# Altium schematic sheet STM32.SchDoc
size A3
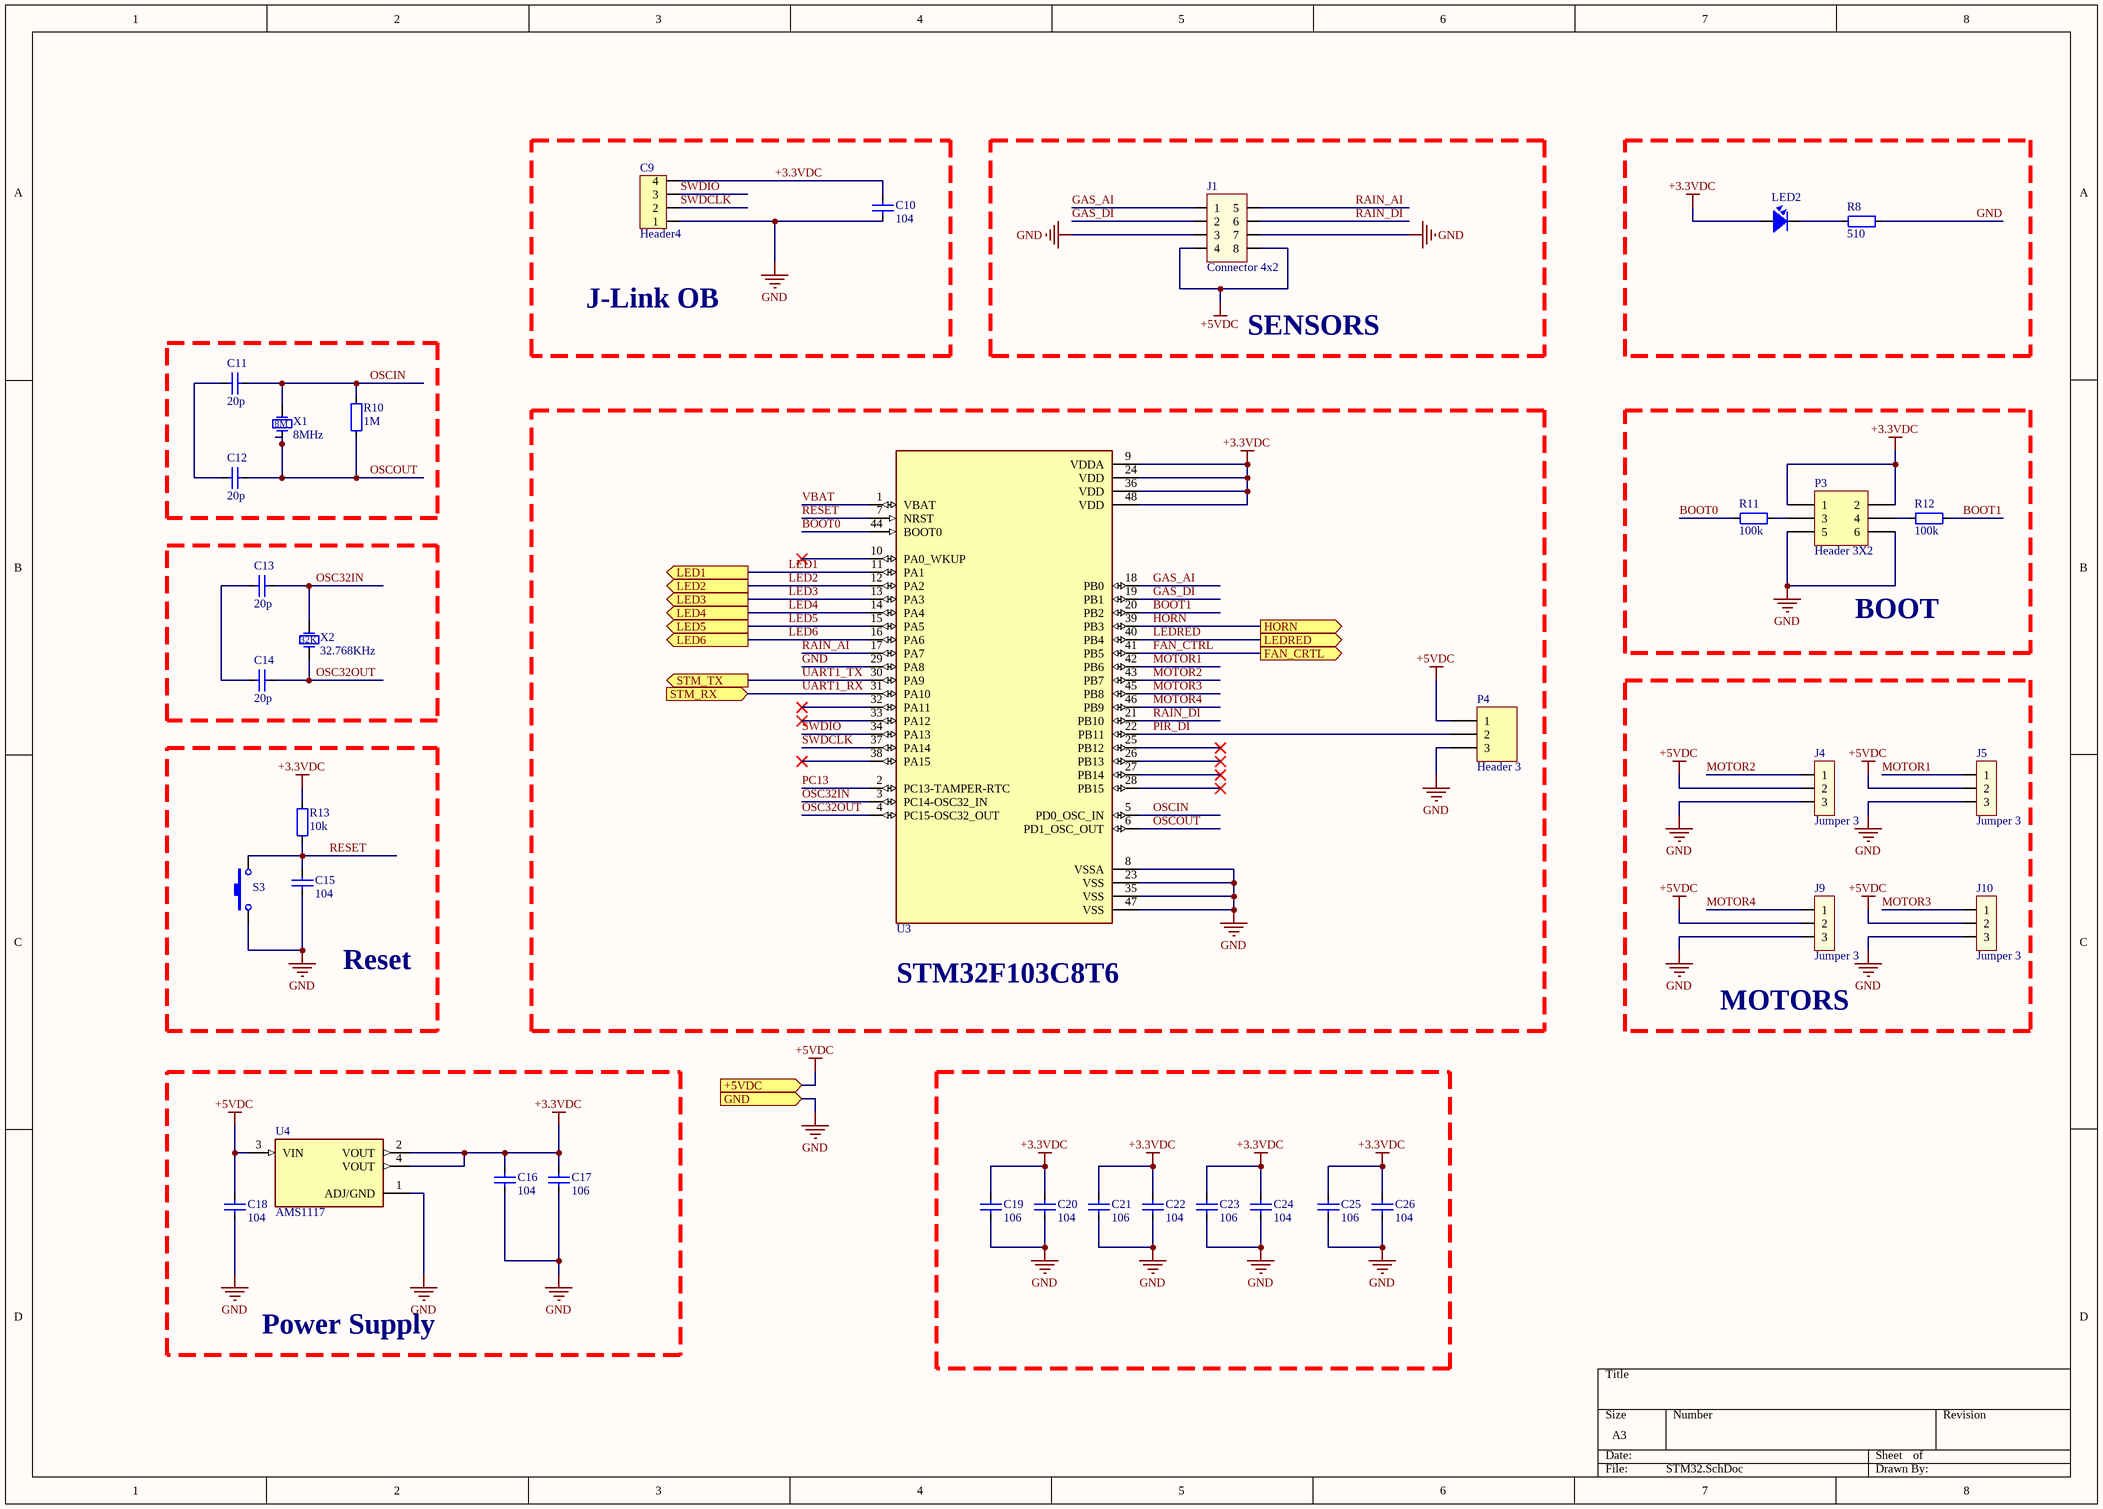
[diagram p0: STM32.SchDoc]

## Parts
C9  Header4  [Header4]
C10  104  [CAP_0805]
C11  20p  [CAP_0805]
C12  20p  [CAP_0805]
C13  20p  [CAP_0805]
C14  20p  [CAP_0805]
C15  104  [CAP_0805]
C16  104  [CAP_0805]
C17  106  [CAP_0805]
C18  104  [CAP_0805]
C19  106  [CAP_0805]
C20  104  [CAP_0805]
C21  106  [CAP_0805]
C22  104  [CAP_0805]
C23  106  [CAP_0805]
C24  104  [CAP_0805]
C25  106  [CAP_0805]
C26  104  [CAP_0805]
J1  Connector 4x2  [JP4x2]
J4  Jumper 3  [JP3]
J5  Jumper 3  [JP3]
J9  Jumper 3  [JP3]
J10  Jumper 3  [JP3]
LED2  LED  [LED-0805-Red]  (value not drawn)
P3  Header 3X2  [HDR2X3]
P4  Header 3  [HDR1X3]
R8  510  [RES-SMD-0805]
R10  1M  [RES-SMD-0805]
R11  100k  [RES-SMD-0805]
R12  100k  [RES-SMD-0805]
R13  10k  [RES-SMD-0805]
S3  SW-SMD  [SW-SMD]  (value not drawn)
U3  STM32  [LQFP 48]  (value not drawn)
U4  AMS1117  [SOT229P700X180-4N]
X1  8MHz  [CRYSTAL_ABM3 5x3.2mm]
X2  32.768KHz  [Crystal_ABS07_SMD-3.2x1.5MM]

## Blocks framed on the sheet
J-Link OB: C9 C10
SENSORS: J1
STM32F103C8T6: P4 U3
BOOT: P3 R11 R12
MOTORS: J4 J5 J9 J10
Reset: C15 R13 S3
Power Supply: C16-C18 U4

## Ports
+5VDC (in), FAN_CRTL (out), GND (in), HORN (out), LED1 (out), LED2 (out), LED3 (out), LED4 (out), LED5 (out), LED6 (out), LEDRED (out), STM_RX (in), STM_TX (out)

## Nets
+3.3VDC: C9.4 C10.2 C16.2 C17.2 C19.2 C20.2 C21.2 C22.2 C23.2 C24.2 C25.2 C26.2 LED2.1 P3.1 P3.2 R13.2 U3.9(VDDA) U3.24(VDD) U3.36(VDD) U3.48(VDD) U4.2(VOUT) U4.4(VOUT)
+5VDC: C18.2 J1.4 J1.8 J4.2 J5.2 J9.2 J10.2 P4.1 U4.3(VIN) ; port +5VDC
GND: C9.1 C10.1 C15.1 C16.1 C17.1 C18.1 C19.1 C20.1 C21.1 C22.1 C23.1 C24.1 C25.1 C26.1 J1.3 J1.7 J4.3 J5.3 J9.3 J10.3 P3.5 P3.6 P4.3 R8.1 S3.1 U3.8(VSSA) U3.23(VSS) U3.29(PA8) U3.35(VSS) U3.47(VSS) U4.1(ADJ/GND) ; port GND
BOOT0: R11.2 U3.44(BOOT0)
BOOT1: R12.1 U3.20(PB2)
FAN_CTRL: U3.41(PB5) ; port FAN_CRTL
GAS_AI: J1.1 U3.18(PB0)
GAS_DI: J1.2 U3.19(PB1)
HORN: U3.39(PB3) ; port HORN
LED1: U3.11(PA1) ; port LED1
LED2: U3.12(PA2) ; port LED2
LED3: U3.13(PA3) ; port LED3
LED4: U3.14(PA4) ; port LED4
LED5: U3.15(PA5) ; port LED5
LED6: U3.16(PA6) ; port LED6
LEDRED: U3.40(PB4) ; port LEDRED
MOTOR1: J5.1 U3.42(PB6)
MOTOR2: J4.1 U3.43(PB7)
MOTOR3: J10.1 U3.45(PB8)
MOTOR4: J9.1 U3.46(PB9)
OSC32IN: C13.1 U3.3(PC14-OSC32_IN) X2.1(OSC1)
OSC32OUT: C14.1 U3.4(PC15-OSC32_OUT) X2.2(OSC2)
OSCIN: C11.1 R10.2 U3.5(PD0_OSC_IN) X1.1(OSC1)
OSCOUT: C12.1 R10.1 U3.6(PD1_OSC_OUT) X1.2(OSC2)
PC13: U3.2(PC13-TAMPER-RTC)
PIR_DI: P4.2 U3.22(PB11)
RAIN_AI: J1.5 U3.17(PA7)
RAIN_DI: J1.6 U3.21(PB10)
RESET: C15.2 R13.1 S3.2 U3.7(NRST)
SWDCLK: C9.2 U3.37(PA14)
SWDIO: C9.3 U3.34(PA13)
UART1_RX: U3.31(PA10) ; port STM_RX
UART1_TX: U3.30(PA9) ; port STM_TX
VBAT: U3.1(VBAT)
NetC11_2: C11.2 C12.2
NetC13_2: C13.2 C14.2
NetLED2_2: LED2.2 R8.2
NetP3_3: P3.3 R11.1
NetP3_4: P3.4 R12.2

Not connected (* = marked no-connect by the designer): U3 10(PA0_WKUP)* 25(PB12)* 26(PB13)* 27(PB14)* 28(PB15)* 32(PA11)* 33(PA12)* 38(PA15)*

## Notes on the sheet
- (in symbol ABM3-8.000MHZ-D2Y-T) 8M
- (in symbol ABS07-32.768KHZ-T) 32K

## Library data of the parts
C9 = Header4: Header IDC, 4 x 1 Pin Vertical 2.54mm Pitch (Non-Boxed, Male); Manufacturer: W¨¹rth Elektronik eiSos GmbH; partNo: 613002143121; ComponentLink1 Description: Manufacturer; ComponentLink2 Description: Datasheet; NoPins: 02; Created Date: 29 March 2013; ComponentLink1URL: http://www.we-online.com; ComponentLink2URL: http://katalog.we-online.de/em/datasheet/6130xx143121.pdf; Created by: Karrer Zheng
C10-C26 = CapSMD: Capacitor; Value: 33p; Published: 8-Jun-2000; LatestRevisionDate: 17-Jul-2002; LatestRevisionNote: Re-released for DXP Platform.; PackageReference: RAD-0.3; Publisher: Altium Limited
J1 = JP4x2: Value: Connector 4x2
J4 J5 J9 J10 = JP3: Value: J3
LED2 = LED: LED Single colour Green and Red; Value: LED 3 ly Single Colour
P3 = Header 3X2: Header, 3-Pin, Dual row; LatestRevisionDate: 17-Jul-2002; LatestRevisionNote: Re-released for DXP Platform.; Publisher: Altium Limited
P4 = Header 3: Header, 3-Pin; LatestRevisionDate: 17-Jul-2002; LatestRevisionNote: Re-released for DXP Platform.; Publisher: Altium Limited
R8 R10-R13 = Resistor - SMD: Resistor; Manufacturer: Generic Components; Class: Passive; Published: 08/06/2000; Publisher: Altium Hobart Technology Centre
S3 = SW-SMD: Switch; Published: 24-Mar-1999; LatestRevisionDate: 17-Jul-2002; LatestRevisionNote: Re-released for DXP Platform.; PackageReference: SPST-2; Publisher: Altium Limited
U3 = STM32F103C8T6: STM32 ARM-based 32-bit MCU with 64 Kbytes Flash, 64-pin LQFP, Industrial Temperature
U4 = AMS1117: 1A LOW DROPOUT VOLTAGE REGULATOR SOT-223; MF: Advanced Monolithic Systems; Price: None; Availability: Not in stock; Package: SOT-223 Seeed Technology; MP: AMS1117; Value: *; SnapEDA_Link: https://www.snapeda.com/parts/AMS1117/Advanced+Monolithic+Systems/view-part/?ref=snap; Check_prices: https://www.snapeda.com/parts/AMS1117/Advanced+Monolithic+Systems/view-part/?ref=eda
X1 = ABM3-8.000MHZ-D2Y-T: CRYSTAL 8.0000MHZ 18pF SMD; Solder: SMT; CompanyID: VT-00517; Value: 8MHz; MPN: ABM3-8.000MHZ-D2Y-T; Category: CRYSTAL
X2 = ABS07-32.768KHZ-T: CRYSTAL 32.7680KHZ 12.5pF SMD; Solder: SMT; CompanyID: VT-01153; MPN: ABS07-32.768KHZ-T; Value: 32.768KHz; Category: CRYSTAL